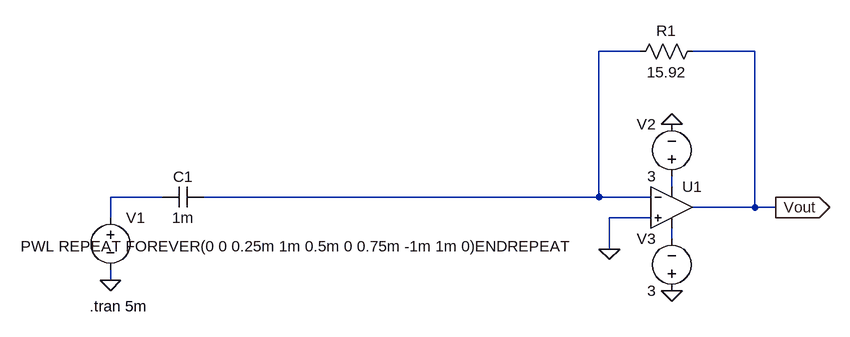
[diagram p0: schematic differentiator_triangularwave.asc]
differentiator_triangularwave.asc, the LTspice schematic file:
Version 4
SHEET 1 880 680
WIRE 224 -80 160 -80
WIRE 400 -80 304 -80
WIRE 272 128 272 112
WIRE -512 144 -592 144
WIRE 160 144 160 -80
WIRE 160 144 -448 144
WIRE 240 144 160 144
WIRE 400 160 400 -80
WIRE 400 160 304 160
WIRE 432 160 400 160
WIRE -592 176 -592 144
WIRE 240 176 176 176
WIRE 272 208 272 192
WIRE 176 224 176 176
WIRE -592 272 -592 256
FLAG 272 32 0
FLAG 272 288 0
FLAG 176 224 0
FLAG -592 272 0
FLAG 432 160 Vout
IOPIN 432 160 Out
SYMBOL voltage -592 160 R0
WINDOW 3 -138 60 Left 2
WINDOW 123 0 0 Left 0
WINDOW 39 0 0 Left 0
SYMATTR Value PWL REPEAT FOREVER(0 0 0.25m 1m 0.5m 0 0.75m -1m 1m 0)ENDREPEAT
SYMATTR InstName V1
SYMBOL voltage 272 128 R180
WINDOW 0 24 96 Left 2
WINDOW 3 24 16 Left 2
SYMATTR InstName V2
SYMATTR Value 3
SYMBOL voltage 272 304 R180
WINDOW 0 24 96 Left 2
WINDOW 3 24 16 Left 2
SYMATTR InstName V3
SYMATTR Value 3
SYMBOL cap -448 128 R90
WINDOW 0 0 32 VBottom 2
WINDOW 3 32 32 VTop 2
SYMATTR InstName C1
SYMATTR Value 1m
SYMBOL res 320 -96 R90
WINDOW 0 0 56 VBottom 2
WINDOW 3 32 56 VTop 2
SYMATTR InstName R1
SYMATTR Value 15.92
SYMBOL Opamps\\UniversalOpamp2 272 160 R0
SYMATTR InstName U1
SYMATTR Value2 Avol=1Meg GBW=100000Meg Slew=10Meg
TEXT -624 312 Left 2 !.tran 5m

The netlist it stands for:
* differentiator_triangularwave.asc
V1 N003 0 PWL REPEAT FOREVER(0 0 0.25m 1m 0.5m 0 0.75m -1m 1m 0)ENDREPEAT
V2 N002 0 3
V3 0 N004 3
C1 N001 N003 1m
R1 Vout N001 15.92
XU1 0 N001 N002 N004 Vout level.2 Avol=1Meg GBW=100000Meg Slew=10Meg ilimit=25m rail=0 Vos=0 phimargin=45 en=0 enk=0 in=0 ink=0 Rin=500Meg  ; pins IN+ IN- V+ V- OUT
.tran 5m
.lib UniversalOpamps2.sub
.backanno
.end